# Altium project X-CARD-Adapter.PrjPcb
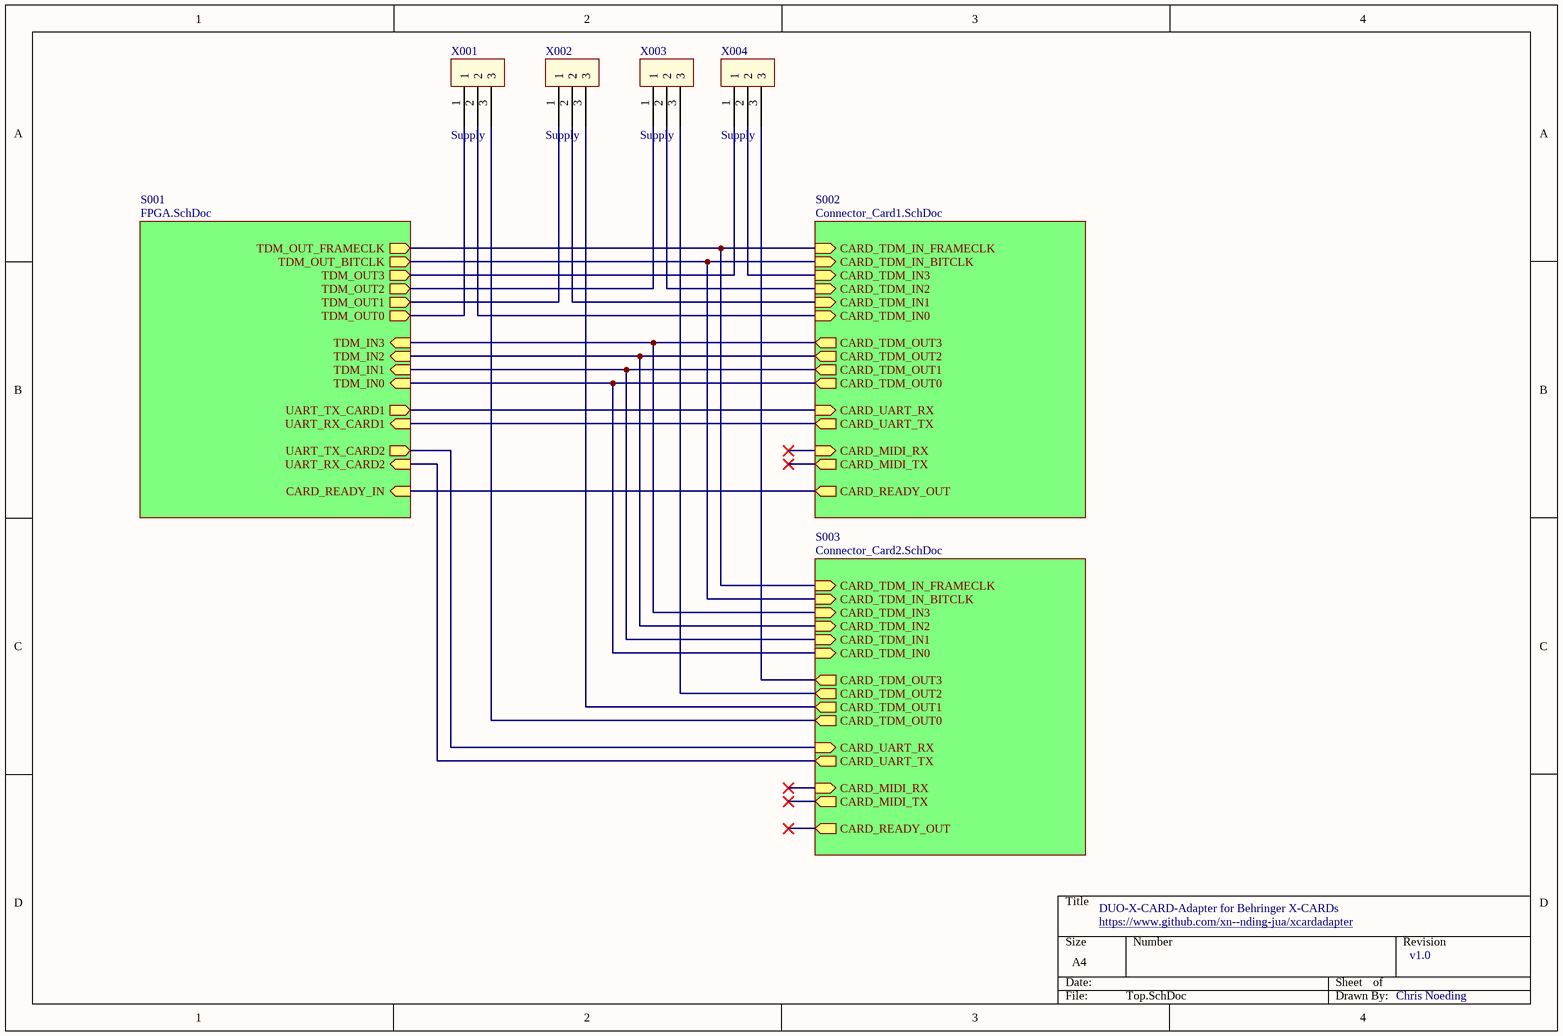
[diagram p0: Top.SchDoc]
4 sheets, 86 parts. Net scope: hierarchical (ports join the sheet entries above them; power ports are global).
Board file: X-CARD-Adapter.PcbDoc
Sheets:
  Top.SchDoc
    S001 = FPGA.SchDoc
    S002 = Connector_Card1.SchDoc
    S003 = Connector_Card2.SchDoc

## Sheet Top.SchDoc
size A4; SheetNumber: 1; SheetTotal: 4

### Parts
X001  Supply  [1x3 Jumper]
X002  Supply  [1x3 Jumper]
X003  Supply  [1x3 Jumper]
X004  Supply  [1x3 Jumper]

### Sub-sheets
S001 = FPGA.SchDoc: TDM_OUT_FRAMECLK (out), TDM_OUT_BITCLK (out), TDM_OUT3 (out), TDM_OUT2 (out), TDM_OUT1 (out), TDM_OUT0 (out), TDM_IN3 (in), TDM_IN2 (in), TDM_IN1 (in), TDM_IN0 (in), UART_TX_CARD1 (out), UART_RX_CARD1 (in), UART_TX_CARD2 (out), UART_RX_CARD2 (in), CARD_READY_IN (in)
S002 = Connector_Card1.SchDoc: CARD_TDM_IN_FRAMECLK (in), CARD_TDM_IN_BITCLK (in), CARD_TDM_IN3 (in), CARD_TDM_IN2 (in), CARD_TDM_IN1 (in), CARD_TDM_IN0 (in), CARD_TDM_OUT3 (out), CARD_TDM_OUT2 (out), CARD_TDM_OUT1 (out), CARD_TDM_OUT0 (out), CARD_UART_RX (in), CARD_UART_TX (out), CARD_MIDI_RX (in), CARD_MIDI_TX (out), CARD_READY_OUT (out)
S003 = Connector_Card2.SchDoc: CARD_TDM_IN_FRAMECLK (in), CARD_TDM_IN_BITCLK (in), CARD_TDM_IN3 (in), CARD_TDM_IN2 (in), CARD_TDM_IN1 (in), CARD_TDM_IN0 (in), CARD_TDM_OUT3 (out), CARD_TDM_OUT2 (out), CARD_TDM_OUT1 (out), CARD_TDM_OUT0 (out), CARD_UART_RX (in), CARD_UART_TX (out), CARD_MIDI_RX (in), CARD_MIDI_TX (out), CARD_READY_OUT (out)

### Nets
NetJ202_1: X004.1 ; sheet S001/TDM_OUT3
NetJ202_9: sheet S001/UART_TX_CARD2, sheet S003/CARD_UART_RX
NetJ202_10: sheet S001/UART_RX_CARD2, sheet S003/CARD_UART_TX
NetJ202_11: sheet S001/TDM_OUT_FRAMECLK, sheet S002/CARD_TDM_IN_FRAMECLK, sheet S003/CARD_TDM_IN_FRAMECLK
NetJ202_12: sheet S001/TDM_OUT_BITCLK, sheet S002/CARD_TDM_IN_BITCLK, sheet S003/CARD_TDM_IN_BITCLK
NetJ202_13: sheet S001/TDM_IN0, sheet S002/CARD_TDM_OUT0, sheet S003/CARD_TDM_IN0
NetJ202_14: sheet S001/TDM_IN1, sheet S002/CARD_TDM_OUT1, sheet S003/CARD_TDM_IN1
NetJ202_20: sheet S001/UART_TX_CARD1, sheet S002/CARD_UART_RX
NetJ202_21: sheet S001/UART_RX_CARD1, sheet S002/CARD_UART_TX
NetJ202_23: sheet S001/CARD_READY_IN, sheet S002/CARD_READY_OUT
NetJ202_24: X003.1 ; sheet S001/TDM_OUT2
NetJ202_25: X002.1 ; sheet S001/TDM_OUT1
NetJ202_26: X001.1 ; sheet S001/TDM_OUT0
NetJ202_27: sheet S001/TDM_IN3, sheet S002/CARD_TDM_OUT3, sheet S003/CARD_TDM_IN3
NetJ202_28: sheet S001/TDM_IN2, sheet S002/CARD_TDM_OUT2, sheet S003/CARD_TDM_IN2
NetR301_2: X001.2 ; sheet S002/CARD_TDM_IN0
NetR302_2: X002.2 ; sheet S002/CARD_TDM_IN1
NetR303_2: X003.2 ; sheet S002/CARD_TDM_IN2
NetR304_2: X004.2 ; sheet S002/CARD_TDM_IN3
NetR405_2: X001.3 ; sheet S003/CARD_TDM_OUT0
NetR406_2: X002.3 ; sheet S003/CARD_TDM_OUT1
NetR407_2: X003.3 ; sheet S003/CARD_TDM_OUT2
NetR408_2: X004.3 ; sheet S003/CARD_TDM_OUT3

### Notes on the sheet
- DUO-X-CARD-Adapter for Behringer X-CARDs
- https://www.github.com/xn--nding-jua/xcardadapter
- v1.0
- Chris Noeding

### Library data of the parts
X001 X002 X003 X004 = 1x3 Jumper

## Sheet FPGA.SchDoc
size A4; SheetNumber: 2; SheetTotal: 4
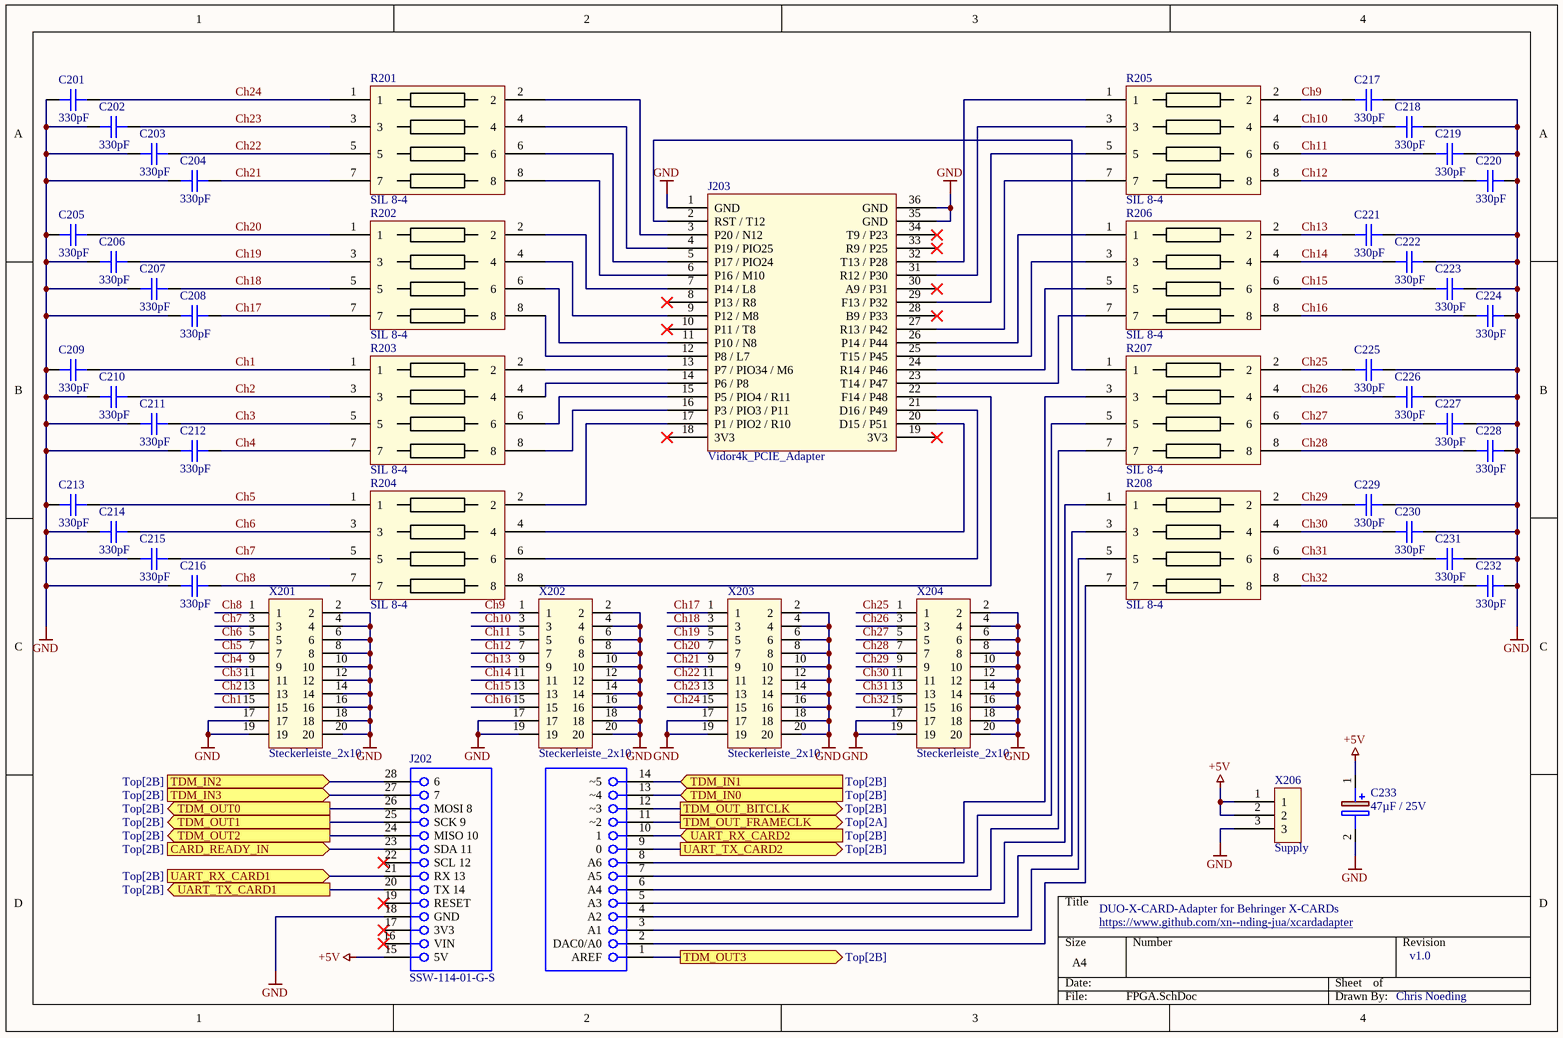
[diagram p1: FPGA.SchDoc]

### Parts
C201  330pF  [1206]
C202  330pF  [1206]
C203  330pF  [1206]
C204  330pF  [1206]
C205  330pF  [1206]
C206  330pF  [1206]
C207  330pF  [1206]
C208  330pF  [1206]
C209  330pF  [1206]
C210  330pF  [1206]
C211  330pF  [1206]
C212  330pF  [1206]
C213  330pF  [1206]
C214  330pF  [1206]
C215  330pF  [1206]
C216  330pF  [1206]
C217  330pF  [1206]
C218  330pF  [1206]
C219  330pF  [1206]
C220  330pF  [1206]
C221  330pF  [1206]
C222  330pF  [1206]
C223  330pF  [1206]
C224  330pF  [1206]
C225  330pF  [1206]
C226  330pF  [1206]
C227  330pF  [1206]
C228  330pF  [1206]
C229  330pF  [1206]
C230  330pF  [1206]
C231  330pF  [1206]
C232  330pF  [1206]
C233  47µF / 25V  [CAPPRD200W50D550H1250]
J202  SSW-114-01-G-S  [SMTC-SSW-114-01-X-S]
J203  Vidor4k_PCIE_Adapter  [Vidor4K_PCIE_Adapter]
R201  SIL 8-4  [SIL8]
R202  SIL 8-4  [SIL8]
R203  SIL 8-4  [SIL8]
R204  SIL 8-4  [SIL8]
R205  SIL 8-4  [SIL8]
R206  SIL 8-4  [SIL8]
R207  SIL 8-4  [SIL8]
R208  SIL 8-4  [SIL8]
X201  Steckerleiste_2x10  [steckerleiste_2x10]
X202  Steckerleiste_2x10  [steckerleiste_2x10]
X203  Steckerleiste_2x10  [steckerleiste_2x10]
X204  Steckerleiste_2x10  [steckerleiste_2x10]
X206  Supply  [1x3 Jumper]

### Ports
CARD_READY_IN (in, see Top[2B]), TDM_IN0 (in, see Top[2B]), TDM_IN1 (in, see Top[2B]), TDM_IN2 (in, see Top[2B]), TDM_IN3 (in, see Top[2B]), TDM_OUT0 (out, see Top[2B]), TDM_OUT1 (out, see Top[2B]), TDM_OUT2 (out, see Top[2B]), TDM_OUT3 (out, see Top[2B]), TDM_OUT_BITCLK (out, see Top[2B]), TDM_OUT_FRAMECLK (out, see Top[2A]), UART_RX_CARD1 (in, see Top[2B]), UART_RX_CARD2 (in, see Top[2B]), UART_TX_CARD1 (out, see Top[2B]), UART_TX_CARD2 (out, see Top[2B])

### Nets
+5V: C233.1(+) J202.15(5V) X206.1 X206.2
GND: C201.2 C202.2 C203.2 C204.2 C205.2 C206.2 C207.2 C208.2 C209.2 C210.2 C211.2 C212.2 C213.2 C214.2 C215.2 C216.2 C217.1 C218.1 C219.1 C220.1 C221.1 C222.1 C223.1 C224.1 C225.1 C226.1 C227.1 C228.1 C229.1 C230.1 C231.1 C232.1 C233.2(-) J202.18(GND) J203.1(GND) J203.35(GND) J203.36(GND) X201.2 X201.4 X201.6 X201.8 X201.10 X201.12 X201.14 X201.16 X201.17 X201.18 X201.19 X201.20 X202.2 X202.4 X202.6 X202.8 X202.10 X202.12 X202.14 X202.16 X202.17 X202.18 X202.19 X202.20 X203.2 X203.4 X203.6 X203.8 X203.10 X203.12 X203.14 X203.16 X203.17 X203.18 X203.19 X203.20 X204.2 X204.4 X204.6 X204.8 X204.10 X204.12 X204.14 X204.16 X204.17 X204.18 X204.19 X204.20 X206.3
Ch1: C209.1 R203.1 X201.15
Ch2: C210.1 R203.3 X201.13
Ch3: C211.1 R203.5 X201.11
Ch4: C212.1 R203.7 X201.9
Ch5: C213.1 R204.1 X201.7
Ch6: C214.1 R204.3 X201.5
Ch7: C215.1 R204.5 X201.3
Ch8: C216.1 R204.7 X201.1
Ch9: C217.2 R205.2 X202.1
Ch10: C218.2 R205.4 X202.3
Ch11: C219.2 R205.6 X202.5
Ch12: C220.2 R205.8 X202.7
Ch13: C221.2 R206.2 X202.9
Ch14: C222.2 R206.4 X202.11
Ch15: C223.2 R206.6 X202.13
Ch16: C224.2 R206.8 X202.15
Ch17: C208.1 R202.7 X203.1
Ch18: C207.1 R202.5 X203.3
Ch19: C206.1 R202.3 X203.5
Ch20: C205.1 R202.1 X203.7
Ch21: C204.1 R201.7 X203.9
Ch22: C203.1 R201.5 X203.11
Ch23: C202.1 R201.3 X203.13
Ch24: C201.1 R201.1 X203.15
Ch25: C225.2 R207.2 X204.1
Ch26: C226.2 R207.4 X204.3
Ch27: C227.2 R207.6 X204.5
Ch28: C228.2 R207.8 X204.7
Ch29: C229.2 R208.2 X204.9
Ch30: C230.2 R208.4 X204.11
Ch31: C231.2 R208.6 X204.13
Ch32: C232.2 R208.8 X204.15
NetJ202_1: J202.1(AREF) ; port TDM_OUT3
NetJ202_2: J202.2(DAC0/A0) R208.7
NetJ202_3: J202.3(A1) R208.5
NetJ202_4: J202.4(A2) R208.3
NetJ202_5: J202.5(A3) R208.1
NetJ202_6: J202.6(A4) R207.7
NetJ202_7: J202.7(A5) R207.5
NetJ202_8: J202.8(A6) R207.3
NetJ202_9: J202.9(0) ; port UART_TX_CARD2
NetJ202_10: J202.10(1) ; port UART_RX_CARD2
NetJ202_11: J202.11(~2) ; port TDM_OUT_FRAMECLK
NetJ202_12: J202.12(~3) ; port TDM_OUT_BITCLK
NetJ202_13: J202.13(~4) ; port TDM_IN0
NetJ202_14: J202.14(~5) ; port TDM_IN1
NetJ202_20: J202.20(TX_14) ; port UART_TX_CARD1
NetJ202_21: J202.21(RX_13) ; port UART_RX_CARD1
NetJ202_23: J202.23(SDA_11) ; port CARD_READY_IN
NetJ202_24: J202.24(MISO_10) ; port TDM_OUT2
NetJ202_25: J202.25(SCK_9) ; port TDM_OUT1
NetJ202_26: J202.26(MOSI_8) ; port TDM_OUT0
NetJ202_27: J202.27(7) ; port TDM_IN3
NetJ202_28: J202.28(6) ; port TDM_IN2
NetJ203_2: J203.2(RST_/_T12) R207.1
NetJ203_3: J203.3(P20_/_N12) R201.2
NetJ203_4: J203.4(P19_/_PIO25) R201.4
NetJ203_5: J203.5(P17_/_PIO24) R201.6
NetJ203_6: J203.6(P16_/_M10) R201.8
NetJ203_7: J203.7(P14_/_L8) R202.2
NetJ203_9: J203.9(P12_/_M8) R202.4
NetJ203_11: J203.11(P10_/_N8) R202.6
NetJ203_12: J203.12(P8_/_L7) R202.8
NetJ203_13: J203.13(P7_/_PIO34_/_M6) R203.2
NetJ203_14: J203.14(P6_/_P8) R203.4
NetJ203_15: J203.15(P5_/_PIO4_/_R11) R203.6
NetJ203_16: J203.16(P3_/_PIO3_/_P11) R203.8
NetJ203_17: J203.17(P1_/_PIO2_/_R10) R204.2
NetJ203_20: J203.20(D15_/_P51) R204.4
NetJ203_21: J203.21(D16_/_P49) R204.6
NetJ203_22: J203.22(F14_/_P48) R204.8
NetJ203_23: J203.23(T14_/_P47) R206.7
NetJ203_24: J203.24(R14_/_P46) R206.5
NetJ203_25: J203.25(T15_/_P45) R206.3
NetJ203_26: J203.26(P14_/_P44) R206.1
NetJ203_27: J203.27(R13_/_P42) R205.7
NetJ203_29: J203.29(F13_/_P32) R205.5
NetJ203_31: J203.31(R12_/_P30) R205.3
NetJ203_32: J203.32(T13_/_P28) R205.1

Not connected (* = marked no-connect by the designer): J202 16(VIN)* 17(3V3)* 19(RESET)* 22(SCL_12)*; J203 8(P13_/_R8)* 10(P11_/_T8)* 18(3V3)* 19(3V3)* 28(B9_/_P33)* 30(A9_/_P31)* 33(R9_/_P25)* 34(T9_/_P23)*

### Notes on the sheet
- DUO-X-CARD-Adapter for Behringer X-CARDs
- https://www.github.com/xn--nding-jua/xcardadapter
- v1.0
- Chris Noeding

### Library data of the parts
C201-C232 = 1206_C_1nF/63V: 1206_C; Text Field1: 06-23225; SMA-ArtikelNr: *
C233 = MAL214256479E3: Capacitor Polarised; Manufacturer_Name: Vishay; Datasheet Link: https://www.vishay.com/docs/28402/142rhs.pdf; Height: 12.5mm; Manufacturer_Part_Number: MAL214256479E3
J202 = Arduino MKR Vidor 4000: SQ Post Socket, Through-hole, Vertical, -55 to 125 degC, 2.54 mm Pitch, 14-Pin, Female, RoHS; Manufacturer: Samtec; Pitch: 2.54 mm; PackageVersion: CA, 6/1987; Mounting Technology: Through-hole; Temperature Range: -55 to 125 degC; Orientation: Vertical; PackageDescription: Assembly, Socket Strip .016 X .031 Tail; ComponentLink1URL: http://www.samtec.com; ComponentLink2URL: http://www.samtec.com/documents/webfiles/pdf/SSW_TH.PDF; ComponentLink1Description: Manufacturer URL; ComponentLink3Description: Package Specification; ComponentLink3URL: http://www.samtec.com/documents/webfiles/cpdf/SSW-1XX-XX-XXX-X-XX-XXX-XX-MKT.pdf; ComponentLink2Description: Datasheet; RoHS: True; PartNumber: SSW-114-01-G-S; PackageReference: SSW-114-01-X-S; DatasheetVersion: F-214
X206 = 1x3 Jumper

## Sheet Connector_Card1.SchDoc
size A4; SheetNumber: 3; SheetTotal: 4
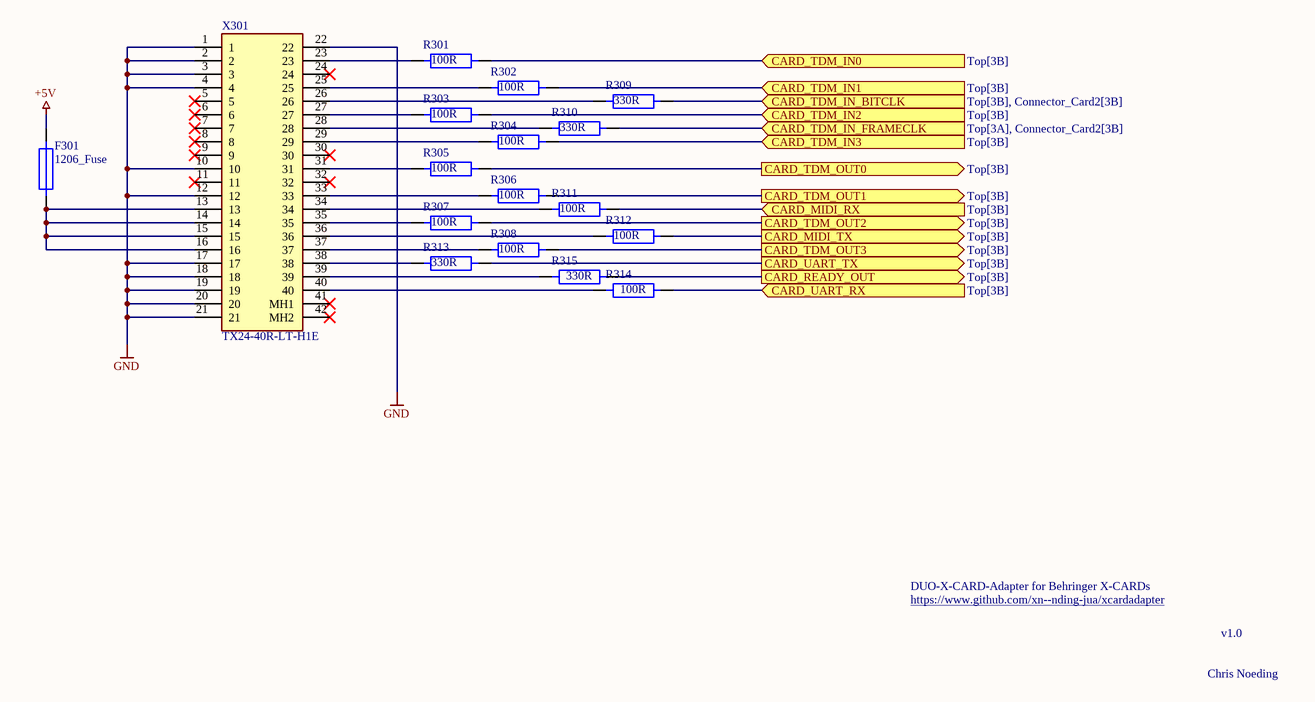
[diagram p2: Connector_Card1.SchDoc]

### Parts
F301  1206_Fuse  [1206]
R301  100R  [1206]
R302  100R  [1206]
R303  100R  [1206]
R304  100R  [1206]
R305  100R  [1206]
R306  100R  [1206]
R307  100R  [1206]
R308  100R  [1206]
R309  330R  [1206]
R310  330R  [1206]
R311  100R  [1206]
R312  100R  [1206]
R313  330R  [1206]
R314  100R  [1206]
R315  330R  [1206]
X301  TX24-40R-LT-H1E  [TX2440RLTH1E]

### Ports
CARD_MIDI_RX (in, see Top[3B]), CARD_MIDI_TX (out, see Top[3B]), CARD_READY_OUT (out, see Top[3B]), CARD_TDM_IN0 (in, see Top[3B]), CARD_TDM_IN1 (in, see Top[3B]), CARD_TDM_IN2 (in, see Top[3B]), CARD_TDM_IN3 (in, see Top[3B]), CARD_TDM_IN_BITCLK (in, see Top[3B], Connector_Card2[3B]), CARD_TDM_IN_FRAMECLK (in, see Top[3A], Connector_Card2[3B]), CARD_TDM_OUT0 (out, see Top[3B]), CARD_TDM_OUT1 (out, see Top[3B]), CARD_TDM_OUT2 (out, see Top[3B]), CARD_TDM_OUT3 (out, see Top[3B]), CARD_UART_RX (in, see Top[3B]), CARD_UART_TX (out, see Top[3B])

### Nets
+5V: F301.2
GND: X301.1 X301.2 X301.3 X301.4 X301.10 X301.12 X301.17 X301.18 X301.19 X301.20 X301.21 X301.22
NetF301_1: F301.1 X301.13 X301.14 X301.15 X301.16
NetJ202_11: R310.2 ; port CARD_TDM_IN_FRAMECLK
NetJ202_12: R309.2 ; port CARD_TDM_IN_BITCLK
NetJ202_13: R305.2 ; port CARD_TDM_OUT0
NetJ202_14: R306.2 ; port CARD_TDM_OUT1
NetJ202_20: R314.2 ; port CARD_UART_RX
NetJ202_21: R313.2 ; port CARD_UART_TX
NetJ202_23: R315.2 ; port CARD_READY_OUT
NetJ202_27: R308.2 ; port CARD_TDM_OUT3
NetJ202_28: R307.2 ; port CARD_TDM_OUT2
NetR301_1: R301.1 X301.23
NetR301_2: R301.2 ; port CARD_TDM_IN0
NetR302_1: R302.1 X301.25
NetR302_2: R302.2 ; port CARD_TDM_IN1
NetR303_1: R303.1 X301.27
NetR303_2: R303.2 ; port CARD_TDM_IN2
NetR304_1: R304.1 X301.29
NetR304_2: R304.2 ; port CARD_TDM_IN3
NetR305_1: R305.1 X301.31
NetR306_1: R306.1 X301.33
NetR307_1: R307.1 X301.35
NetR308_1: R308.1 X301.37
NetR309_1: R309.1 X301.26
NetR310_1: R310.1 X301.28
NetR311_1: R311.1 X301.34
NetR311_2: R311.2 ; port CARD_MIDI_RX
NetR312_1: R312.1 X301.36
NetR312_2: R312.2 ; port CARD_MIDI_TX
NetR313_1: R313.1 X301.38
NetR314_1: R314.1 X301.40
NetR315_1: R315.1 X301.39

Not connected (* = marked no-connect by the designer): X301 5* 6* 7* 8* 9* 11* 24* 30* 32* 41(MH1)* 42(MH2)*

### Notes on the sheet
- DUO-X-CARD-Adapter for Behringer X-CARDs
- https://www.github.com/xn--nding-jua/xcardadapter
- v1.0
- Chris Noeding

### Library data of the parts
R301-R304 R307-R315 = 1206_R: SMA-ArtikelNr: *
R305 R306 = 1206_R: 330R; SMA-ArtikelNr: *
X301 = TX24-40R-LT-H1E: Connector; Manufacturer_Name: JAE; Datasheet Link: https://www.jae.com/direct/topics/topics_file_download/topics_id=66739&ext_no=06&index=0&_lang=en&v=; Height: 9.2mm; Manufacturer_Part_Number: TX24-40R-LT-H1E; Mouser Part Number: 656-TX24-40R-LT-H1E; Mouser Price/Stock: https://www.mouser.co.uk/ProductDetail/JAE-Electronics/TX24-40R-LT-H1E?qs=qo47cMy2QCeuMLTrRKCbyg%3D%3D
F301 = 1206_Fuse: SMA-ArtikelNr: *

## Sheet Connector_Card2.SchDoc
size A4; SheetNumber: 4; SheetTotal: 4
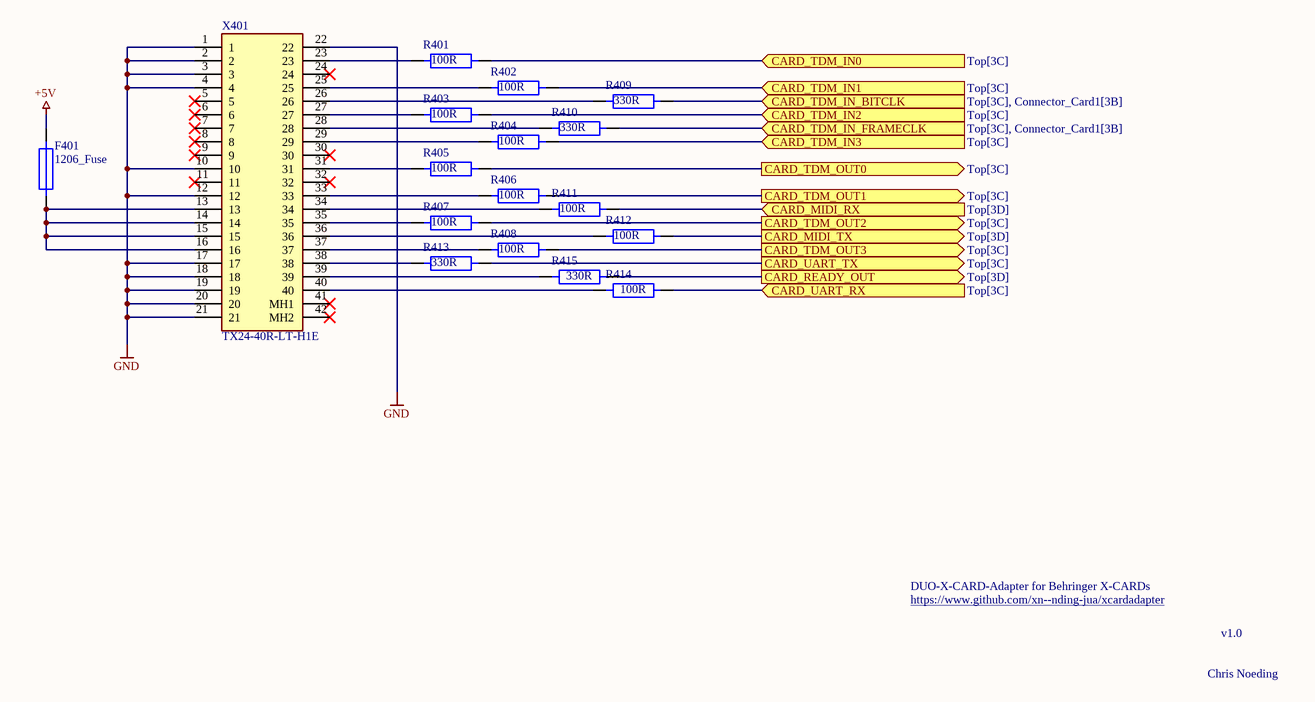
[diagram p3: Connector_Card2.SchDoc]

### Parts
F401  1206_Fuse  [1206]
R401  100R  [1206]
R402  100R  [1206]
R403  100R  [1206]
R404  100R  [1206]
R405  100R  [1206]
R406  100R  [1206]
R407  100R  [1206]
R408  100R  [1206]
R409  330R  [1206]
R410  330R  [1206]
R411  100R  [1206]
R412  100R  [1206]
R413  330R  [1206]
R414  100R  [1206]
R415  330R  [1206]
X401  TX24-40R-LT-H1E  [TX2440RLTH1E]

### Ports
CARD_MIDI_RX (in, see Top[3D]), CARD_MIDI_TX (out, see Top[3D]), CARD_READY_OUT (out, see Top[3D]), CARD_TDM_IN0 (in, see Top[3C]), CARD_TDM_IN1 (in, see Top[3C]), CARD_TDM_IN2 (in, see Top[3C]), CARD_TDM_IN3 (in, see Top[3C]), CARD_TDM_IN_BITCLK (in, see Top[3C], Connector_Card1[3B]), CARD_TDM_IN_FRAMECLK (in, see Top[3C], Connector_Card1[3B]), CARD_TDM_OUT0 (out, see Top[3C]), CARD_TDM_OUT1 (out, see Top[3C]), CARD_TDM_OUT2 (out, see Top[3C]), CARD_TDM_OUT3 (out, see Top[3C]), CARD_UART_RX (in, see Top[3C]), CARD_UART_TX (out, see Top[3C])

### Nets
+5V: F401.2
GND: X401.1 X401.2 X401.3 X401.4 X401.10 X401.12 X401.17 X401.18 X401.19 X401.20 X401.21 X401.22
NetF401_1: F401.1 X401.13 X401.14 X401.15 X401.16
NetJ202_9: R414.2 ; port CARD_UART_RX
NetJ202_10: R413.2 ; port CARD_UART_TX
NetJ202_11: R410.2 ; port CARD_TDM_IN_FRAMECLK
NetJ202_12: R409.2 ; port CARD_TDM_IN_BITCLK
NetJ202_13: R401.2 ; port CARD_TDM_IN0
NetJ202_14: R402.2 ; port CARD_TDM_IN1
NetJ202_27: R404.2 ; port CARD_TDM_IN3
NetJ202_28: R403.2 ; port CARD_TDM_IN2
NetR401_1: R401.1 X401.23
NetR402_1: R402.1 X401.25
NetR403_1: R403.1 X401.27
NetR404_1: R404.1 X401.29
NetR405_1: R405.1 X401.31
NetR405_2: R405.2 ; port CARD_TDM_OUT0
NetR406_1: R406.1 X401.33
NetR406_2: R406.2 ; port CARD_TDM_OUT1
NetR407_1: R407.1 X401.35
NetR407_2: R407.2 ; port CARD_TDM_OUT2
NetR408_1: R408.1 X401.37
NetR408_2: R408.2 ; port CARD_TDM_OUT3
NetR409_1: R409.1 X401.26
NetR410_1: R410.1 X401.28
NetR411_1: R411.1 X401.34
NetR411_2: R411.2 ; port CARD_MIDI_RX
NetR412_1: R412.1 X401.36
NetR412_2: R412.2 ; port CARD_MIDI_TX
NetR413_1: R413.1 X401.38
NetR414_1: R414.1 X401.40
NetR415_1: R415.1 X401.39
NetR415_2: R415.2 ; port CARD_READY_OUT

Not connected (* = marked no-connect by the designer): X401 5* 6* 7* 8* 9* 11* 24* 30* 32* 41(MH1)* 42(MH2)*

### Notes on the sheet
- DUO-X-CARD-Adapter for Behringer X-CARDs
- https://www.github.com/xn--nding-jua/xcardadapter
- v1.0
- Chris Noeding

### Library data of the parts
R401-R404 R407-R415 = 1206_R: SMA-ArtikelNr: *
R405 R406 = 1206_R: 330R; SMA-ArtikelNr: *
X401 = TX24-40R-LT-H1E: Connector; Manufacturer_Name: JAE; Datasheet Link: https://www.jae.com/direct/topics/topics_file_download/topics_id=66739&ext_no=06&index=0&_lang=en&v=; Height: 9.2mm; Manufacturer_Part_Number: TX24-40R-LT-H1E; Mouser Part Number: 656-TX24-40R-LT-H1E; Mouser Price/Stock: https://www.mouser.co.uk/ProductDetail/JAE-Electronics/TX24-40R-LT-H1E?qs=qo47cMy2QCeuMLTrRKCbyg%3D%3D
F401 = 1206_Fuse: SMA-ArtikelNr: *

## Nets that join several sheets
+5V: FPGA (C233.1 J202.15 X206.1 X206.2), Connector_Card1 (F301.2), Connector_Card2 (F401.2)
GND: FPGA (86 pins), Connector_Card1 (12 pins), Connector_Card2 (12 pins)
NetJ202_1: Top (X004.1), FPGA (J202.1)
NetJ202_9: FPGA (J202.9), Connector_Card2 (R414.2)
NetJ202_10: FPGA (J202.10), Connector_Card2 (R413.2)
NetJ202_11: FPGA (J202.11), Connector_Card1 (R310.2), Connector_Card2 (R410.2)
NetJ202_12: FPGA (J202.12), Connector_Card1 (R309.2), Connector_Card2 (R409.2)
NetJ202_13: FPGA (J202.13), Connector_Card1 (R305.2), Connector_Card2 (R401.2)
NetJ202_14: FPGA (J202.14), Connector_Card1 (R306.2), Connector_Card2 (R402.2)
NetJ202_20: FPGA (J202.20), Connector_Card1 (R314.2)
NetJ202_21: FPGA (J202.21), Connector_Card1 (R313.2)
NetJ202_23: FPGA (J202.23), Connector_Card1 (R315.2)
NetJ202_24: Top (X003.1), FPGA (J202.24)
NetJ202_25: Top (X002.1), FPGA (J202.25)
NetJ202_26: Top (X001.1), FPGA (J202.26)
NetJ202_27: FPGA (J202.27), Connector_Card1 (R308.2), Connector_Card2 (R404.2)
NetJ202_28: FPGA (J202.28), Connector_Card1 (R307.2), Connector_Card2 (R403.2)
NetR301_2: Top (X001.2), Connector_Card1 (R301.2)
NetR302_2: Top (X002.2), Connector_Card1 (R302.2)
NetR303_2: Top (X003.2), Connector_Card1 (R303.2)
NetR304_2: Top (X004.2), Connector_Card1 (R304.2)
NetR405_2: Top (X001.3), Connector_Card2 (R405.2)
NetR406_2: Top (X002.3), Connector_Card2 (R406.2)
NetR407_2: Top (X003.3), Connector_Card2 (R407.2)
NetR408_2: Top (X004.3), Connector_Card2 (R408.2)